# Altium schematic sheet CAN Module.SchDoc
size A4; SheetNumber: 4; SheetTotal: 5
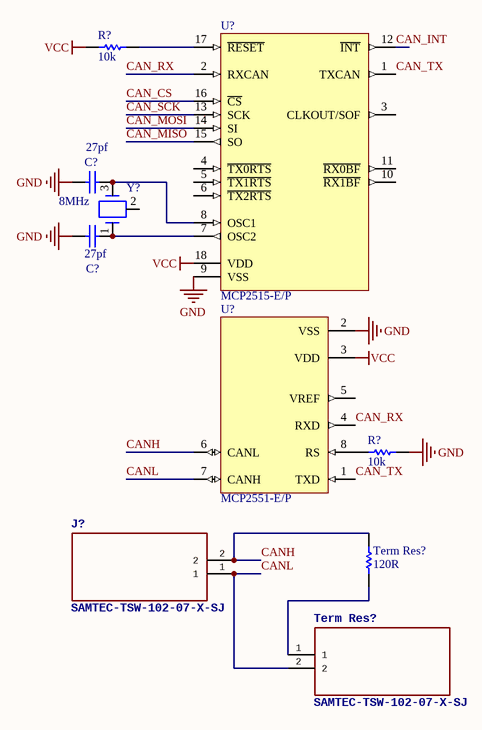
[diagram p0: CAN Module.SchDoc]

## Parts
(Parts that share a designator on the sheet are numbered #1, #2 ... from top to bottom, then left to right.)
C?#1  27pf  [KEMT-C330C105M5U5TA]
C?#2  27pf  [KEMT-C330C105M5U5TA]
J?  SAMTEC-TSW-102-07-X-SJ  [SAMTEC-TSW-102-07-X-S]
R?#1  10k  [VISH-A1-2_V2]
R?#2  10k  [VISH-A1-2_V2]
Term_Res?#1  120R  [VISH-A1-2_V2]
Term_Res?#2  SAMTEC-TSW-102-07-X-SJ  [SAMTEC-TSW-102-07-X-S]
U?#1  MCP2515-E/P  [PDIP300-P18]
U?#2  MCP2551-E/P  [PDIP300-P8]
Y?  8MHz  [ECS-4X-3IL]

## Nets
GND: C?#1.2 C?#2.2 R?#2.1 U?#1.9(VSS) U?#2.2(VSS)
VCC: R?#1.2 U?#1.18(VDD) U?#2.3(VDD)
CAN_CS: U?#1.16(~{CS})
CAN_INT: U?#1.12(~{INT})
CAN_MISO: U?#1.15(SO)
CAN_MOSI: U?#1.14(SI)
CAN_RX: U?#1.2(RXCAN) U?#2.4(RXD)
CAN_SCK: U?#1.13(SCK)
CAN_TX: U?#1.1(TXCAN) U?#2.1(TXD)
CANH: J?.2 Term_Res?#1.1 U?#2.6(CANL)
CANL: J?.1 Term_Res?#2.2 U?#2.7(CANH)
NetC?#1_1: C?#1.1 U?#1.8(OSC1) Y?.3
NetC?#2_1: C?#2.1 U?#1.7(OSC2) Y?.1
NetR?#1_1: R?#1.1 U?#1.17(~{RESET})
NetR?#2_2: R?#2.2 U?#2.8(RS)
NetTerm_Res?#1_2: Term_Res?#1.2 Term_Res?#2.1

Not connected (* = marked no-connect by the designer): U?#1 3(CLKOUT/SOF) 4(~{TX0RTS}) 5(~{TX1RTS}) 6(~{TX2RTS}) 10(~{RX1BF}) 11(~{RX0BF}); U?#2 5(VREF); Y? 2

## Library data of the parts
C?#1 C?#2 = CMP-2000-06056-1: Ceramic Capacitor, 1 uF, +/- 20%, 50 V, -10 to 85 degC, 2-Pin THD, RoHS, Bulk; Manufacturer: Kemet; Voltage - Rated: 50V; Temperature Coefficient: Z5U; Catalog Drawings: C330(std); Product Training Modules: CapacitorBasics-TypicalUsesforCapacitors; Capacitance: 1µF; Online Catalog: GoldenMax™Series; Other Names: 399-4390; PCN Design/Specification: C3yySeriesGoldenMaxLeadConfiguration02/Feb/2015; Thickness (Max): -; Size / Dimension: 0.300"Lx0.150"W(7.62mmx3.81mm); Mounting Technology: ThroughHole; Tolerance: ±20%; Mounting Type: ThroughHole; Datasheet URL: http://www.kemet.com/Lists/ProductCatalog/Attachments/599/KEM_C1051_GOLDMAX_Z5U.pdf; Series: GoldenMax™; Standard Package: 250; Ratings: -; Applications: GeneralPurpose; Package Reference: C330C105M5U5TA; Packaging: Bulk; Category: Capacitors; Package Description: 2-Pin Through Hole Device, Body 7.11 x 4.07 mm; Operating Temperature: 10°C~85°C; Height - Seated (Max): 0.360"(9.14mm); Manufacturer URL: http://www.kemet.com/; Lead Spacing: 0.200"(5.08mm); Features: -; Lead Style: Straight; Package / Case: Radial; Family: CeramicCapacitors; Datasheet Version: 12/2015
R?#1 R?#2 Term_Res?#1 = CMP-1240-00001-1: Power Metal Film Leaded Resistor, 62 KOhm +/-5%, 2 W, 2-Pin THD, RoHS, Ammo Pack; PartNumber: PR02000206202JA100; Manufacturer: Vishay Semiconductor; Resistance: 62 KOhm; Temperature Coefficient: +/-250 ppm/degC; Power: 2 W; ComponentLink2URL: http://www.vishay.com/docs/28729/28729.pdf; Mounting Technology: Through Hole; Tolerance: +/-5%; ComponentLink3Description: Package Specification; ComponentLink3URL: http://www.vishay.com/docs/28729/28729.pdf; ComponentLink1Description: Manufacturer URL; ComponentLink2Description: Datasheet; DatasheetVersion: Jun-13; PackageDescription: 2-Pin Axial Lead, Body 10 x 3.9 mm; ComponentLink1URL: http://www.vishay.com/; Packing: Ammo Pack; RoHS: TRUE
U?#1 = CMP-0186-00008-2: Stand-Alone CAN Controller With SPI Interface, 18-Pin PDIP, Extended Temperature; RevisionNote: URLs added. DatasheetVersion updated.; PackageReference: PDIP300-P18; ComponentLink1Description: Manufacturer URL; ComponentLink1URL: http://www.microchip.com/; Code_JEDEC: MS-001; ComponentLink3URL: http://www.microchip.com/stellent/groups/techpub_sg/documents/packagingspec/en012702.pdf; ComponentLink2Description: Datasheet; PackageDescription: 18-Lead Plastic Dual In-Line (P) - 300 mil Body [PDIP]; ComponentLink3Description: Package Specification; PackageVersion: revBB, Aug-2009; ComponentLink2URL: http://ww1.microchip.com/downloads/en/DeviceDoc/21801f.pdf; DatasheetVersion: revF, Oct-2010
U?#2 = CMP-0186-00100-2: High-Speed CAN Transceiver, 8-Pin PDIP, Extended Temperature; PackageReference: PDIP300-P8; DatasheetVersion: revF, Jul-2010; ComponentLink2URL: http://ww1.microchip.com/downloads/en/DeviceDoc/21667F.pdf; ComponentLink2Description: Datasheet; Code_JEDEC: MS-001; ComponentLink1URL: http://www.microchip.com/; RevisionNote: URLs added. DatasheetVersion updated.; PackageVersion: revBB, Aug-2009; ComponentLink3Description: Package Specification; PackageDescription: 8-Lead Plastic Dual In-Line (P) - 300 mil Body [PDIP]; ComponentLink1Description: Manufacturer URL; ComponentLink3URL: http://www.microchip.com/stellent/groups/techpub_sg/documents/packagingspec/en012702.pdf
Y? = CMP-1669-00002-2: CRYSTAL 8.00 MHZ 20PF 49US; PartNumber: ECS-80-20-4X; Manufacturer: ECS; ComponentLink1URL: http://www.ecsxtal.com/store/pdf/hc-49usx.pdf; ComponentLink1Description: Datasheet; PackageReference: 4X-3IL